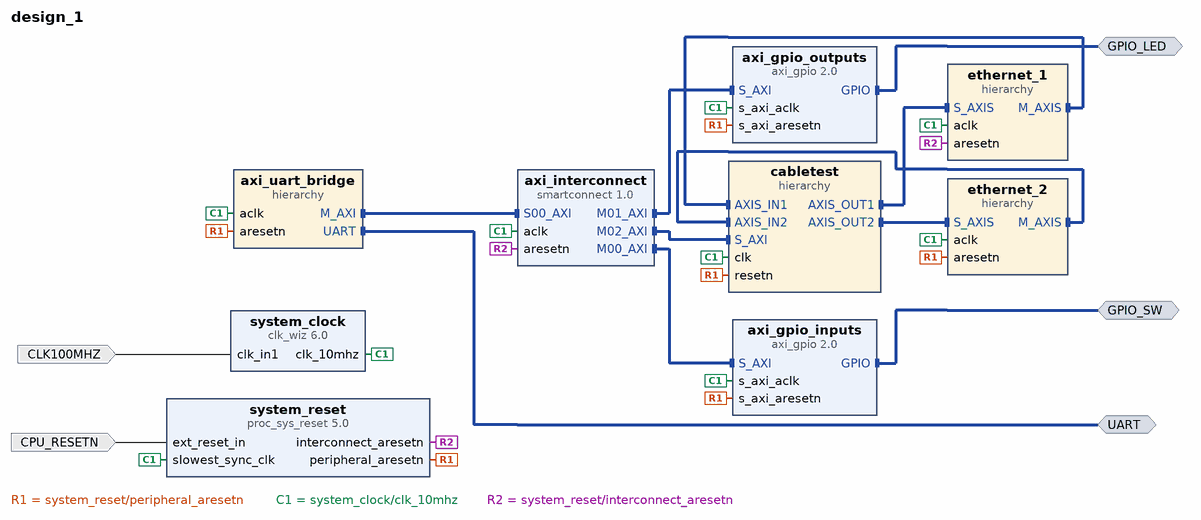
[diagram p0: block diagram of the top level]
# Vivado block design design_1, xc7a100tcsg324-1, Vivado 2021.1
create_bd_design design_1

create_bd_intf_port -mode Master -vlnv xilinx.com:interface:gpio_rtl:1.0 GPIO_LED
create_bd_intf_port -mode Master -vlnv xilinx.com:interface:gpio_rtl:1.0 GPIO_SW
create_bd_intf_port -mode Master -vlnv xilinx.com:interface:uart_rtl:1.0 UART
create_bd_port -dir I -type clk CLK100MHZ
set_property -dict {CONFIG.ASSOCIATED_RESET CPU_RESETN} [get_bd_ports CLK100MHZ]
create_bd_port -dir I -type rst CPU_RESETN

create_bd_cell -type ip -vlnv xilinx.com:ip:clk_wiz:6.0 system_clock
set_property -dict [list \
  CONFIG.CLKOUT1_DRIVES BUFGCE \
  CONFIG.CLKOUT1_JITTER 151.636 \
  CONFIG.CLKOUT1_PHASE_ERROR 98.575 \
  CONFIG.CLKOUT1_REQUESTED_OUT_FREQ 50.00 \
  CONFIG.CLKOUT2_DRIVES BUFGCE \
  CONFIG.CLKOUT3_DRIVES BUFGCE \
  CONFIG.CLKOUT4_DRIVES BUFGCE \
  CONFIG.CLKOUT5_DRIVES BUFGCE \
  CONFIG.CLKOUT6_DRIVES BUFGCE \
  CONFIG.CLKOUT7_DRIVES BUFGCE \
  CONFIG.CLK_OUT1_PORT clk_10mhz \
  CONFIG.FEEDBACK_SOURCE FDBK_AUTO \
  CONFIG.MMCM_CLKFBOUT_MULT_F 10.000 \
  CONFIG.MMCM_CLKOUT0_DIVIDE_F 20.000 \
  CONFIG.MMCM_DIVCLK_DIVIDE 1 \
  CONFIG.USE_LOCKED false \
  CONFIG.USE_RESET false \
  CONFIG.USE_SAFE_CLOCK_STARTUP true \
] [get_bd_cells system_clock]
create_bd_cell -type ip -vlnv xilinx.com:ip:proc_sys_reset:5.0 system_reset
set_property -dict {CONFIG.RESET_BOARD_INTERFACE reset CONFIG.USE_BOARD_FLOW true} [get_bd_cells system_reset]
create_bd_cell -type ip -vlnv xilinx.com:ip:smartconnect:1.0 axi_interconnect
set_property -dict {CONFIG.NUM_MI 4 CONFIG.NUM_SI 1} [get_bd_cells axi_interconnect]
create_bd_cell -type ip -vlnv xilinx.com:ip:axi_gpio:2.0 axi_gpio_inputs
set_property -dict [list \
  CONFIG.C_GPIO_WIDTH 4 \
  CONFIG.GPIO_BOARD_INTERFACE Custom \
  CONFIG.USE_BOARD_FLOW true \
] [get_bd_cells axi_gpio_inputs]
create_bd_cell -type ip -vlnv xilinx.com:ip:axi_gpio:2.0 axi_gpio_outputs
set_property -dict [list \
  CONFIG.C_ALL_INPUTS 0 \
  CONFIG.C_ALL_OUTPUTS 1 \
  CONFIG.C_GPIO_WIDTH 4 \
  CONFIG.GPIO_BOARD_INTERFACE Custom \
  CONFIG.USE_BOARD_FLOW true \
] [get_bd_cells axi_gpio_outputs]
create_bd_cell -type hier axi_uart_bridge
create_bd_cell -type hier cabletest
create_bd_cell -type hier ethernet_1
create_bd_cell -type hier ethernet_2

# ---- hierarchy /axi_uart_bridge ----
current_bd_instance /axi_uart_bridge
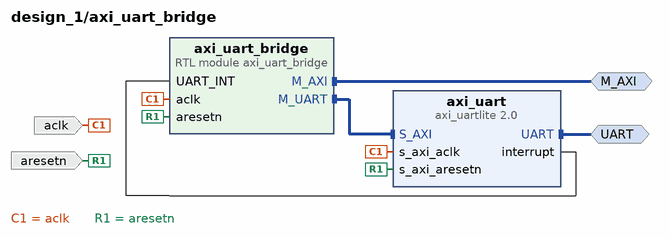
[diagram p1: block diagram inside /axi_uart_bridge]
create_bd_intf_pin -mode Master -vlnv xilinx.com:interface:aximm_rtl:1.0 M_AXI
create_bd_intf_pin -mode Master -vlnv xilinx.com:interface:uart_rtl:1.0 UART
create_bd_pin -dir I -type clk aclk
create_bd_pin -dir I -type rst aresetn

create_bd_cell -type ip -vlnv xilinx.com:ip:axi_uartlite:2.0 axi_uart
set_property -dict [list \
  CONFIG.C_BAUDRATE 115200 \
  CONFIG.UARTLITE_BOARD_INTERFACE Custom \
  CONFIG.USE_BOARD_FLOW true \
] [get_bd_cells axi_uart]
create_bd_cell -type module -reference axi_uart_bridge axi_uart_bridge
set_property -dict {CONFIG.CLOCK_FREQ 50000000} [get_bd_cells axi_uart_bridge]

# ---- hierarchy /cabletest ----
current_bd_instance /cabletest
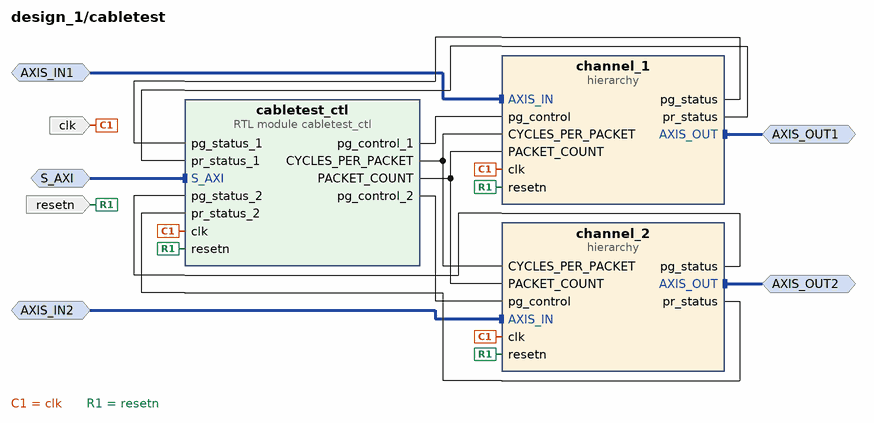
[diagram p2: block diagram inside /cabletest]
create_bd_intf_pin -mode Slave -vlnv xilinx.com:interface:aximm_rtl:1.0 S_AXI
create_bd_intf_pin -mode Master -vlnv xilinx.com:interface:axis_rtl:1.0 AXIS_OUT1
create_bd_intf_pin -mode Slave -vlnv xilinx.com:interface:axis_rtl:1.0 AXIS_IN1
create_bd_intf_pin -mode Slave -vlnv xilinx.com:interface:axis_rtl:1.0 AXIS_IN2
create_bd_intf_pin -mode Master -vlnv xilinx.com:interface:axis_rtl:1.0 AXIS_OUT2
create_bd_pin -dir I -type clk clk
create_bd_pin -dir I -type rst resetn

create_bd_cell -type hier channel_1
create_bd_cell -type hier channel_2
create_bd_cell -type module -reference cabletest_ctl cabletest_ctl

# ---- hierarchy /cabletest/channel_1 ----
current_bd_instance /cabletest/channel_1
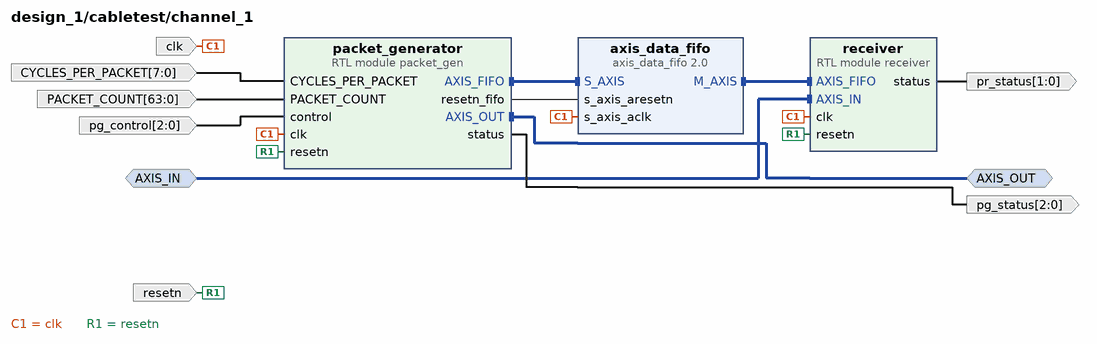
[diagram p3: block diagram inside /cabletest/channel_1]
create_bd_intf_pin -mode Master -vlnv xilinx.com:interface:axis_rtl:1.0 AXIS_OUT
create_bd_intf_pin -mode Slave -vlnv xilinx.com:interface:axis_rtl:1.0 AXIS_IN
create_bd_pin -dir I -type clk clk
create_bd_pin -dir I -type rst resetn
create_bd_pin -dir I -from 63 -to 0 PACKET_COUNT
create_bd_pin -dir I -from 7 -to 0 CYCLES_PER_PACKET
create_bd_pin -dir I -from 2 -to 0 pg_control
create_bd_pin -dir O -from 2 -to 0 pg_status
create_bd_pin -dir O -from 1 -to 0 pr_status

create_bd_cell -type ip -vlnv xilinx.com:ip:axis_data_fifo:2.0 axis_data_fifo
create_bd_cell -type module -reference packet_gen packet_generator
create_bd_cell -type module -reference receiver receiver

# ---- hierarchy /cabletest/channel_2 ----
current_bd_instance /cabletest/channel_2
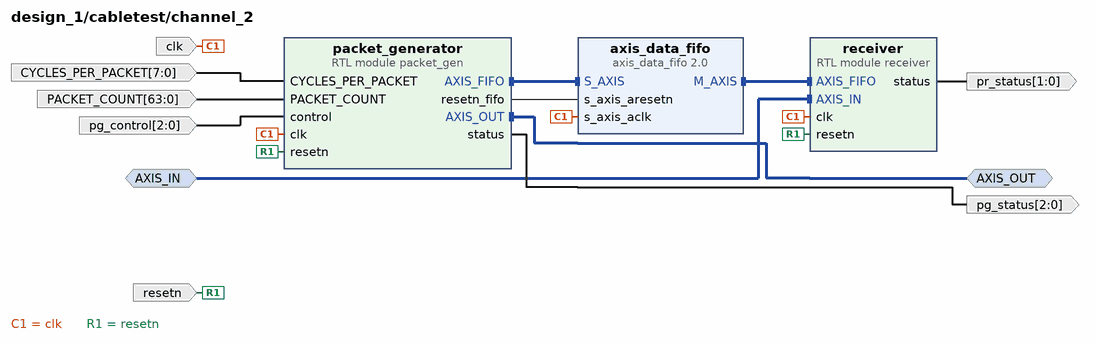
[diagram p4: block diagram inside /cabletest/channel_2]
create_bd_intf_pin -mode Master -vlnv xilinx.com:interface:axis_rtl:1.0 AXIS_OUT
create_bd_intf_pin -mode Slave -vlnv xilinx.com:interface:axis_rtl:1.0 AXIS_IN
create_bd_pin -dir I -type clk clk
create_bd_pin -dir I -type rst resetn
create_bd_pin -dir I -from 63 -to 0 PACKET_COUNT
create_bd_pin -dir I -from 7 -to 0 CYCLES_PER_PACKET
create_bd_pin -dir I -from 2 -to 0 pg_control
create_bd_pin -dir O -from 2 -to 0 pg_status
create_bd_pin -dir O -from 1 -to 0 pr_status

create_bd_cell -type ip -vlnv xilinx.com:ip:axis_data_fifo:2.0 axis_data_fifo
create_bd_cell -type module -reference packet_gen packet_generator
create_bd_cell -type module -reference receiver receiver

# ---- hierarchy /ethernet_1 ----
current_bd_instance /ethernet_1
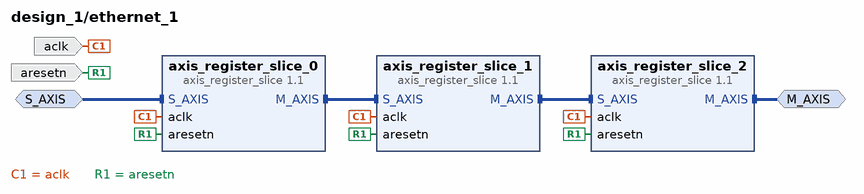
[diagram p5: block diagram inside /ethernet_1]
create_bd_intf_pin -mode Slave -vlnv xilinx.com:interface:axis_rtl:1.0 S_AXIS
create_bd_intf_pin -mode Master -vlnv xilinx.com:interface:axis_rtl:1.0 M_AXIS
create_bd_pin -dir I -type clk aclk
create_bd_pin -dir I -type rst aresetn

create_bd_cell -type ip -vlnv xilinx.com:ip:axis_register_slice:1.1 axis_register_slice_0
create_bd_cell -type ip -vlnv xilinx.com:ip:axis_register_slice:1.1 axis_register_slice_1
create_bd_cell -type ip -vlnv xilinx.com:ip:axis_register_slice:1.1 axis_register_slice_2

# ---- hierarchy /ethernet_2 ----
current_bd_instance /ethernet_2
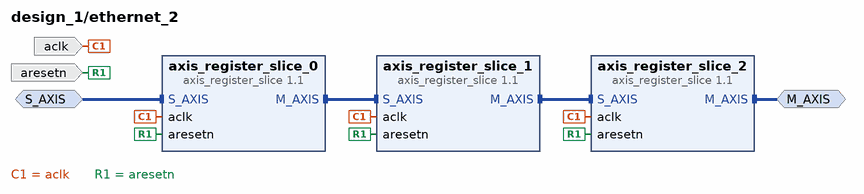
[diagram p6: block diagram inside /ethernet_2]
create_bd_intf_pin -mode Slave -vlnv xilinx.com:interface:axis_rtl:1.0 S_AXIS
create_bd_intf_pin -mode Master -vlnv xilinx.com:interface:axis_rtl:1.0 M_AXIS
create_bd_pin -dir I -type clk aclk
create_bd_pin -dir I -type rst aresetn

create_bd_cell -type ip -vlnv xilinx.com:ip:axis_register_slice:1.1 axis_register_slice_0
create_bd_cell -type ip -vlnv xilinx.com:ip:axis_register_slice:1.1 axis_register_slice_1
create_bd_cell -type ip -vlnv xilinx.com:ip:axis_register_slice:1.1 axis_register_slice_2

# ---- connections ----

current_bd_instance /axi_uart_bridge
connect_bd_intf_net [get_bd_intf_pins UART] [get_bd_intf_pins axi_uart/UART]
connect_bd_intf_net [get_bd_intf_pins M_AXI] [get_bd_intf_pins axi_uart_bridge/M_AXI]
connect_bd_intf_net [get_bd_intf_pins axi_uart_bridge/M_UART] [get_bd_intf_pins axi_uart/S_AXI]
connect_bd_net [get_bd_pins aclk] [get_bd_pins axi_uart/s_axi_aclk] [get_bd_pins axi_uart_bridge/aclk]
connect_bd_net [get_bd_pins aresetn] [get_bd_pins axi_uart/s_axi_aresetn] [get_bd_pins axi_uart_bridge/aresetn]
connect_bd_net [get_bd_pins axi_uart/interrupt] [get_bd_pins axi_uart_bridge/UART_INT]

current_bd_instance /cabletest
connect_bd_intf_net [get_bd_intf_pins AXIS_IN1] [get_bd_intf_pins channel_1/AXIS_IN]
connect_bd_intf_net [get_bd_intf_pins AXIS_IN2] [get_bd_intf_pins channel_2/AXIS_IN]
connect_bd_intf_net [get_bd_intf_pins S_AXI] [get_bd_intf_pins cabletest_ctl/S_AXI]
connect_bd_intf_net [get_bd_intf_pins AXIS_OUT2] [get_bd_intf_pins channel_2/AXIS_OUT]
connect_bd_intf_net [get_bd_intf_pins AXIS_OUT1] [get_bd_intf_pins channel_1/AXIS_OUT]
connect_bd_net [get_bd_pins cabletest_ctl/CYCLES_PER_PACKET] [get_bd_pins channel_1/CYCLES_PER_PACKET] [get_bd_pins channel_2/CYCLES_PER_PACKET]
connect_bd_net [get_bd_pins cabletest_ctl/PACKET_COUNT] [get_bd_pins channel_1/PACKET_COUNT] [get_bd_pins channel_2/PACKET_COUNT]
connect_bd_net [get_bd_pins cabletest_ctl/pg_control_1] [get_bd_pins channel_1/pg_control]
connect_bd_net [get_bd_pins cabletest_ctl/pg_control_2] [get_bd_pins channel_2/pg_control]
connect_bd_net -net channel_1_status [get_bd_pins channel_1/pg_status] [get_bd_pins cabletest_ctl/pg_status_1]
connect_bd_net -net channel_1_status1 [get_bd_pins channel_1/pr_status] [get_bd_pins cabletest_ctl/pr_status_1]
connect_bd_net -net channel_2_status [get_bd_pins channel_2/pg_status] [get_bd_pins cabletest_ctl/pg_status_2]
connect_bd_net -net channel_2_status1 [get_bd_pins channel_2/pr_status] [get_bd_pins cabletest_ctl/pr_status_2]
connect_bd_net [get_bd_pins clk] [get_bd_pins channel_1/clk] [get_bd_pins channel_2/clk] [get_bd_pins cabletest_ctl/clk]
connect_bd_net [get_bd_pins resetn] [get_bd_pins channel_1/resetn] [get_bd_pins channel_2/resetn] [get_bd_pins cabletest_ctl/resetn]

current_bd_instance /cabletest/channel_1
connect_bd_intf_net [get_bd_intf_pins AXIS_IN] [get_bd_intf_pins receiver/AXIS_IN]
connect_bd_intf_net [get_bd_intf_pins AXIS_OUT] [get_bd_intf_pins packet_generator/AXIS_OUT]
connect_bd_intf_net [get_bd_intf_pins axis_data_fifo/M_AXIS] [get_bd_intf_pins receiver/AXIS_FIFO]
connect_bd_intf_net [get_bd_intf_pins packet_generator/AXIS_FIFO] [get_bd_intf_pins axis_data_fifo/S_AXIS]
connect_bd_net [get_bd_pins CYCLES_PER_PACKET] [get_bd_pins packet_generator/CYCLES_PER_PACKET]
connect_bd_net [get_bd_pins PACKET_COUNT] [get_bd_pins packet_generator/PACKET_COUNT]
connect_bd_net [get_bd_pins clk] [get_bd_pins axis_data_fifo/s_axis_aclk] [get_bd_pins packet_generator/clk] [get_bd_pins receiver/clk]
connect_bd_net -net control_1 [get_bd_pins pg_control] [get_bd_pins packet_generator/control]
connect_bd_net -net packet_gen_0_resetn_fifo [get_bd_pins packet_generator/resetn_fifo] [get_bd_pins axis_data_fifo/s_axis_aresetn]
connect_bd_net [get_bd_pins packet_generator/status] [get_bd_pins pg_status]
connect_bd_net [get_bd_pins receiver/status] [get_bd_pins pr_status]
connect_bd_net [get_bd_pins resetn] [get_bd_pins packet_generator/resetn] [get_bd_pins receiver/resetn]

current_bd_instance /cabletest/channel_2
connect_bd_intf_net [get_bd_intf_pins AXIS_IN] [get_bd_intf_pins receiver/AXIS_IN]
connect_bd_intf_net [get_bd_intf_pins AXIS_OUT] [get_bd_intf_pins packet_generator/AXIS_OUT]
connect_bd_intf_net [get_bd_intf_pins axis_data_fifo/M_AXIS] [get_bd_intf_pins receiver/AXIS_FIFO]
connect_bd_intf_net [get_bd_intf_pins packet_generator/AXIS_FIFO] [get_bd_intf_pins axis_data_fifo/S_AXIS]
connect_bd_net [get_bd_pins CYCLES_PER_PACKET] [get_bd_pins packet_generator/CYCLES_PER_PACKET]
connect_bd_net [get_bd_pins PACKET_COUNT] [get_bd_pins packet_generator/PACKET_COUNT]
connect_bd_net [get_bd_pins clk] [get_bd_pins axis_data_fifo/s_axis_aclk] [get_bd_pins packet_generator/clk] [get_bd_pins receiver/clk]
connect_bd_net -net control_1 [get_bd_pins pg_control] [get_bd_pins packet_generator/control]
connect_bd_net -net packet_gen_0_resetn_fifo [get_bd_pins packet_generator/resetn_fifo] [get_bd_pins axis_data_fifo/s_axis_aresetn]
connect_bd_net [get_bd_pins packet_generator/status] [get_bd_pins pg_status]
connect_bd_net [get_bd_pins receiver/status] [get_bd_pins pr_status]
connect_bd_net [get_bd_pins resetn] [get_bd_pins packet_generator/resetn] [get_bd_pins receiver/resetn]

current_bd_instance /ethernet_1
connect_bd_intf_net [get_bd_intf_pins S_AXIS] [get_bd_intf_pins axis_register_slice_0/S_AXIS]
connect_bd_intf_net [get_bd_intf_pins axis_register_slice_0/M_AXIS] [get_bd_intf_pins axis_register_slice_1/S_AXIS]
connect_bd_intf_net [get_bd_intf_pins axis_register_slice_1/M_AXIS] [get_bd_intf_pins axis_register_slice_2/S_AXIS]
connect_bd_intf_net [get_bd_intf_pins M_AXIS] [get_bd_intf_pins axis_register_slice_2/M_AXIS]
connect_bd_net [get_bd_pins aclk] \
  [get_bd_pins axis_register_slice_0/aclk] [get_bd_pins axis_register_slice_2/aclk] [get_bd_pins axis_register_slice_1/aclk]
connect_bd_net [get_bd_pins aresetn] \
  [get_bd_pins axis_register_slice_0/aresetn] [get_bd_pins axis_register_slice_1/aresetn] \
  [get_bd_pins axis_register_slice_2/aresetn]

current_bd_instance /ethernet_2
connect_bd_intf_net [get_bd_intf_pins S_AXIS] [get_bd_intf_pins axis_register_slice_0/S_AXIS]
connect_bd_intf_net [get_bd_intf_pins axis_register_slice_0/M_AXIS] [get_bd_intf_pins axis_register_slice_1/S_AXIS]
connect_bd_intf_net [get_bd_intf_pins axis_register_slice_1/M_AXIS] [get_bd_intf_pins axis_register_slice_2/S_AXIS]
connect_bd_intf_net [get_bd_intf_pins M_AXIS] [get_bd_intf_pins axis_register_slice_2/M_AXIS]
connect_bd_net [get_bd_pins aclk] \
  [get_bd_pins axis_register_slice_0/aclk] [get_bd_pins axis_register_slice_2/aclk] [get_bd_pins axis_register_slice_1/aclk]
connect_bd_net [get_bd_pins aresetn] \
  [get_bd_pins axis_register_slice_0/aresetn] [get_bd_pins axis_register_slice_1/aresetn] \
  [get_bd_pins axis_register_slice_2/aresetn]

current_bd_instance /
connect_bd_intf_net [get_bd_intf_pins cabletest/AXIS_IN2] [get_bd_intf_pins ethernet_2/M_AXIS]
connect_bd_intf_net [get_bd_intf_pins cabletest/AXIS_IN1] [get_bd_intf_pins ethernet_1/M_AXIS]
connect_bd_intf_net [get_bd_intf_ports GPIO_SW] [get_bd_intf_pins axi_gpio_inputs/GPIO]
connect_bd_intf_net [get_bd_intf_ports GPIO_LED] [get_bd_intf_pins axi_gpio_outputs/GPIO]
connect_bd_intf_net [get_bd_intf_pins axi_interconnect/M00_AXI] [get_bd_intf_pins axi_gpio_inputs/S_AXI]
connect_bd_intf_net [get_bd_intf_pins axi_gpio_outputs/S_AXI] [get_bd_intf_pins axi_interconnect/M01_AXI]
connect_bd_intf_net [get_bd_intf_pins axi_interconnect/M02_AXI] [get_bd_intf_pins cabletest/S_AXI]
connect_bd_intf_net [get_bd_intf_pins cabletest/AXIS_OUT1] [get_bd_intf_pins ethernet_1/S_AXIS]
connect_bd_intf_net [get_bd_intf_pins cabletest/AXIS_OUT2] [get_bd_intf_pins ethernet_2/S_AXIS]
connect_bd_intf_net [get_bd_intf_pins axi_interconnect/S00_AXI] [get_bd_intf_pins axi_uart_bridge/M_AXI]
connect_bd_intf_net [get_bd_intf_ports UART] [get_bd_intf_pins axi_uart_bridge/UART]
connect_bd_net -net clk_in1_0_1 [get_bd_ports CLK100MHZ] [get_bd_pins system_clock/clk_in1]
connect_bd_net -net ext_reset_in_0_1 [get_bd_ports CPU_RESETN] [get_bd_pins system_reset/ext_reset_in]
connect_bd_net -net proc_sys_reset_0_peripheral_aresetn [get_bd_pins system_reset/peripheral_aresetn] \
  [get_bd_pins axi_gpio_inputs/s_axi_aresetn] [get_bd_pins axi_gpio_outputs/s_axi_aresetn] \
  [get_bd_pins axi_uart_bridge/aresetn] [get_bd_pins cabletest/resetn] [get_bd_pins ethernet_2/aresetn]
connect_bd_net -net system_clock_clk_100mhz [get_bd_pins system_clock/clk_10mhz] \
  [get_bd_pins system_reset/slowest_sync_clk] [get_bd_pins axi_interconnect/aclk] [get_bd_pins axi_gpio_inputs/s_axi_aclk] \
  [get_bd_pins axi_gpio_outputs/s_axi_aclk] [get_bd_pins axi_uart_bridge/aclk] [get_bd_pins cabletest/clk] \
  [get_bd_pins ethernet_1/aclk] [get_bd_pins ethernet_2/aclk]
connect_bd_net [get_bd_pins system_reset/interconnect_aresetn] [get_bd_pins axi_interconnect/aresetn] [get_bd_pins ethernet_1/aresetn]

# ---- address map ----
assign_bd_address -offset 0x0000000000001000 -range 256 -target_address_space [get_bd_addr_spaces axi_uart_bridge/axi_uart_bridge/M_AXI] [get_bd_addr_segs cabletest/cabletest_ctl/S_AXI/reg0]
assign_bd_address -offset 0x0000000040000000 -range 64K -target_address_space [get_bd_addr_spaces axi_uart_bridge/axi_uart_bridge/M_AXI] [get_bd_addr_segs axi_gpio_inputs/S_AXI/Reg]
assign_bd_address -offset 0x0000000040010000 -range 64K -target_address_space [get_bd_addr_spaces axi_uart_bridge/axi_uart_bridge/M_AXI] [get_bd_addr_segs axi_gpio_outputs/S_AXI/Reg]
assign_bd_address -offset 0x40600000 -range 64K -target_address_space [get_bd_addr_spaces axi_uart_bridge/axi_uart_bridge/M_UART] [get_bd_addr_segs axi_uart_bridge/axi_uart/S_AXI/Reg]

validate_bd_design
save_bd_design
